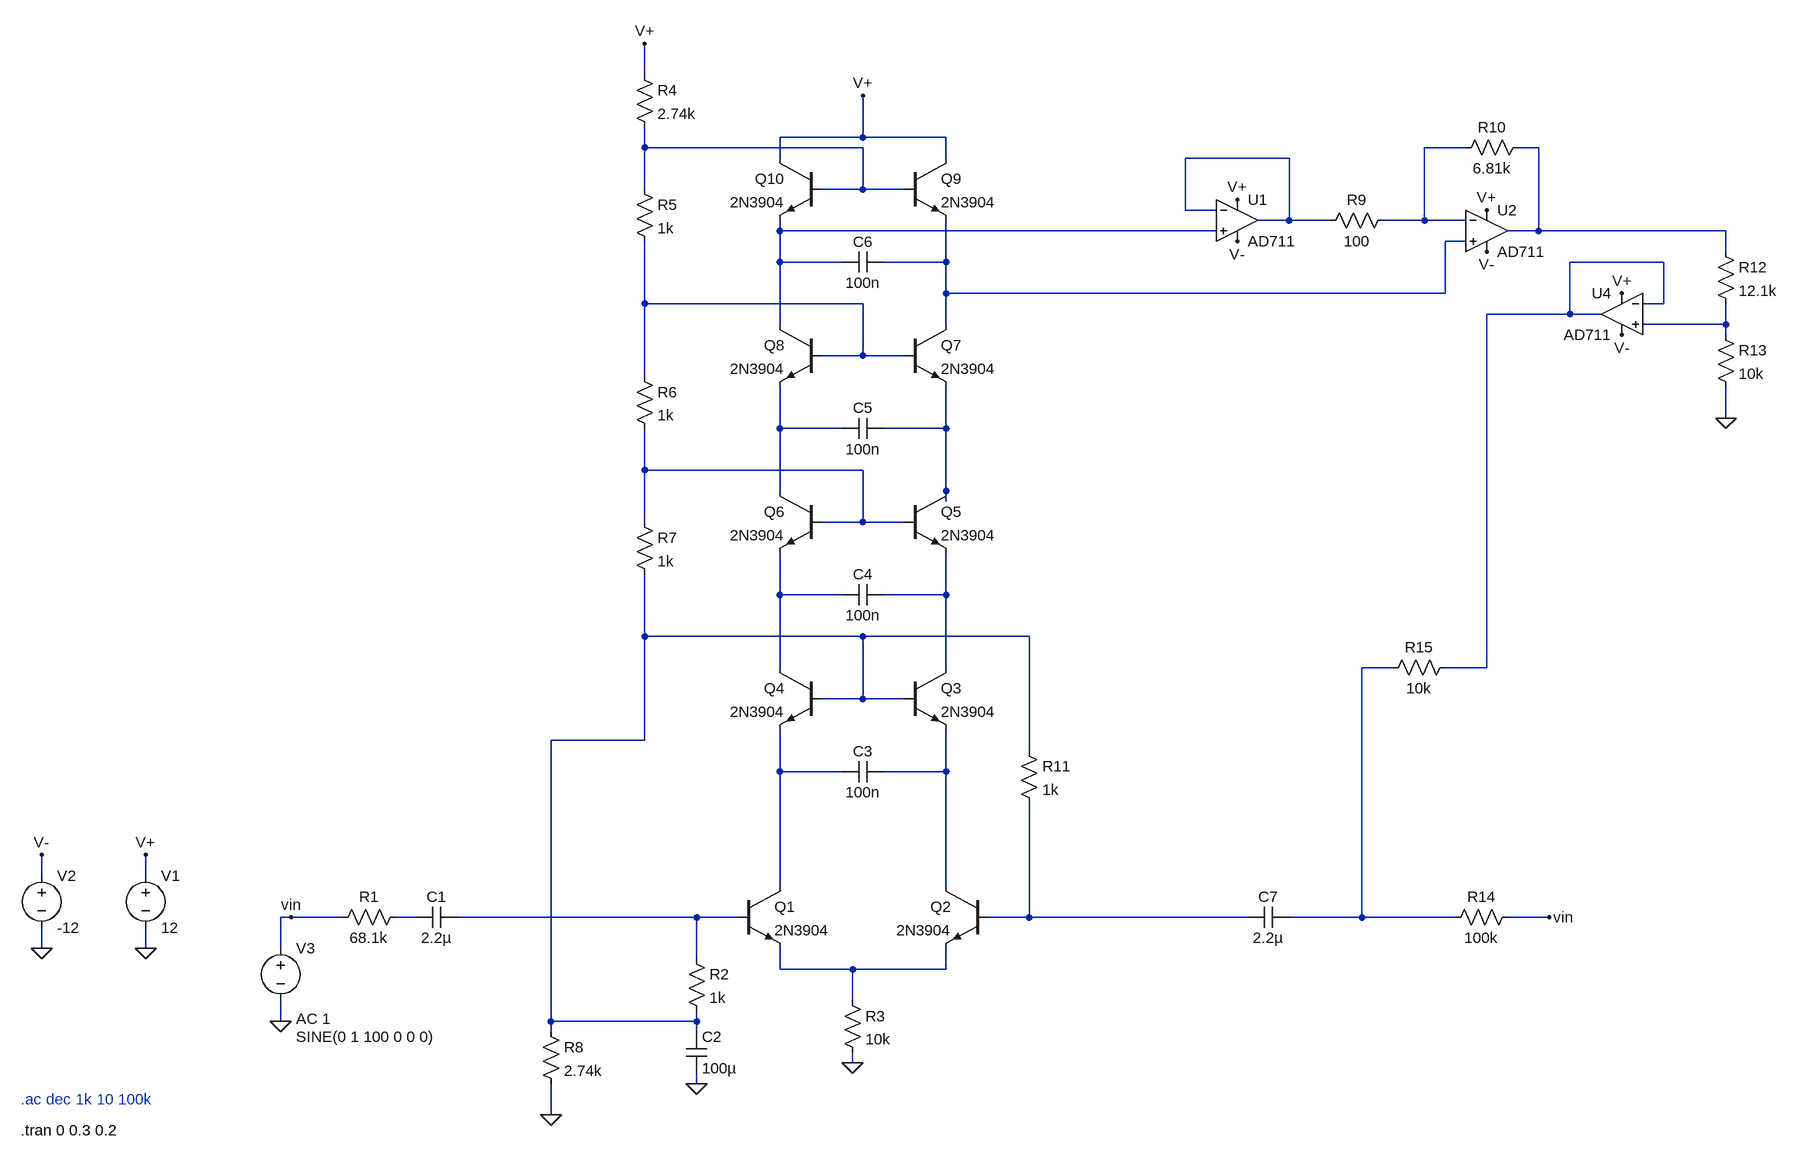
[diagram p0: schematic ladder filter.asc]
ladder filter.asc, the LTspice schematic file:
Version 4.1
SHEET 1 1992 680
WIRE 240 -1136 240 -1184
WIRE 576 -1040 576 -1104
WIRE 576 -1040 448 -1040
WIRE 704 -1040 576 -1040
WIRE 240 -1024 240 -1056
WIRE 576 -1024 240 -1024
WIRE 1504 -1024 1440 -1024
WIRE 1616 -1024 1584 -1024
WIRE 448 -1008 448 -1040
WIRE 704 -1008 704 -1040
WIRE 1232 -1008 1072 -1008
WIRE 240 -960 240 -1024
WIRE 576 -960 576 -1024
WIRE 576 -960 512 -960
WIRE 640 -960 576 -960
WIRE 1072 -928 1072 -1008
WIRE 1120 -928 1072 -928
WIRE 1232 -912 1232 -1008
WIRE 1232 -912 1184 -912
WIRE 1296 -912 1232 -912
WIRE 1440 -912 1440 -1024
WIRE 1440 -912 1376 -912
WIRE 1504 -912 1440 -912
WIRE 448 -896 448 -912
WIRE 1120 -896 448 -896
WIRE 1616 -896 1616 -1024
WIRE 1616 -896 1568 -896
WIRE 1904 -896 1616 -896
WIRE 1504 -880 1472 -880
WIRE 1904 -864 1904 -896
WIRE 448 -848 448 -896
WIRE 544 -848 448 -848
WIRE 704 -848 704 -912
WIRE 704 -848 608 -848
WIRE 1808 -848 1664 -848
WIRE 704 -800 704 -848
WIRE 1472 -800 1472 -880
WIRE 1472 -800 704 -800
WIRE 240 -784 240 -880
WIRE 576 -784 240 -784
WIRE 1808 -784 1808 -848
WIRE 1808 -784 1776 -784
WIRE 1664 -768 1664 -848
WIRE 1664 -768 1536 -768
WIRE 1712 -768 1664 -768
WIRE 448 -752 448 -848
WIRE 704 -752 704 -800
WIRE 1904 -752 1904 -784
WIRE 1904 -752 1776 -752
WIRE 1904 -736 1904 -752
WIRE 576 -704 576 -784
WIRE 576 -704 512 -704
WIRE 640 -704 576 -704
WIRE 240 -672 240 -784
WIRE 1904 -608 1904 -656
WIRE 448 -592 448 -656
WIRE 544 -592 448 -592
WIRE 704 -592 704 -656
WIRE 704 -592 608 -592
WIRE 240 -528 240 -592
WIRE 576 -528 240 -528
WIRE 448 -496 448 -592
WIRE 704 -496 704 -592
WIRE 704 -480 704 -496
WIRE 240 -448 240 -528
WIRE 576 -448 576 -528
WIRE 576 -448 512 -448
WIRE 640 -448 576 -448
WIRE 448 -336 448 -400
WIRE 544 -336 448 -336
WIRE 704 -336 704 -400
WIRE 704 -336 608 -336
WIRE 240 -272 240 -368
WIRE 576 -272 240 -272
WIRE 832 -272 576 -272
WIRE 448 -224 448 -336
WIRE 704 -224 704 -336
WIRE 1392 -224 1344 -224
WIRE 1536 -224 1536 -768
WIRE 1536 -224 1472 -224
WIRE 576 -176 576 -272
WIRE 576 -176 512 -176
WIRE 640 -176 576 -176
WIRE 240 -112 240 -272
WIRE 240 -112 96 -112
WIRE 832 -96 832 -272
WIRE 448 -64 448 -128
WIRE 544 -64 448 -64
WIRE 704 -64 704 -128
WIRE 704 -64 608 -64
WIRE -688 96 -688 64
WIRE -528 96 -528 64
WIRE 448 112 448 -64
WIRE 704 112 704 -64
WIRE -304 160 -320 160
WIRE -224 160 -304 160
WIRE -112 160 -144 160
WIRE 320 160 -48 160
WIRE 384 160 320 160
WIRE 832 160 832 -16
WIRE 832 160 768 160
WIRE 1168 160 832 160
WIRE 1344 160 1344 -224
WIRE 1344 160 1232 160
WIRE 1488 160 1344 160
WIRE 1632 160 1568 160
WIRE -688 208 -688 176
WIRE -528 208 -528 176
WIRE -320 208 -320 160
WIRE 320 224 320 160
WIRE 448 240 448 208
WIRE 560 240 448 240
WIRE 704 240 704 208
WIRE 704 240 560 240
WIRE 560 288 560 240
WIRE -320 320 -320 288
WIRE 96 320 96 -112
WIRE 320 320 320 304
WIRE 320 320 96 320
WIRE 96 336 96 320
WIRE 320 336 320 320
WIRE 560 384 560 368
WIRE 320 416 320 400
WIRE 96 464 96 416
FLAG 320 416 0
FLAG 560 384 0
FLAG -528 208 0
FLAG -528 64 V+
FLAG 240 -1184 V+
FLAG 576 -1104 V+
FLAG 96 464 0
FLAG -688 208 0
FLAG -688 64 V-
FLAG 1152 -880 V-
FLAG 1152 -944 V+
FLAG 1536 -864 V-
FLAG 1536 -928 V+
FLAG -320 320 0
FLAG -304 160 vin
FLAG 1632 160 vin
FLAG 1744 -800 V+
FLAG 1744 -736 V-
FLAG 1904 -608 0
SYMBOL cap -48 144 R90
WINDOW 0 0 32 VBottom 2
WINDOW 3 32 32 VTop 2
SYMATTR InstName C1
SYMATTR Value 2.2µ
SYMBOL res -128 144 R90
WINDOW 0 0 56 VBottom 2
WINDOW 3 32 56 VTop 2
SYMATTR InstName R1
SYMATTR Value 68.1k
SYMBOL npn 384 112 R0
SYMATTR InstName Q1
SYMATTR Value 2N3904
SYMBOL npn 768 112 M0
SYMATTR InstName Q2
SYMATTR Value 2N3904
SYMBOL res 304 208 R0
SYMATTR InstName R2
SYMATTR Value 1k
SYMBOL cap 304 336 R0
SYMATTR InstName C2
SYMATTR Value 100µ
SYMBOL res 544 272 R0
SYMATTR InstName R3
SYMATTR Value 10k
SYMBOL voltage -528 80 R0
WINDOW 123 0 0 Left 0
WINDOW 39 0 0 Left 0
SYMATTR InstName V1
SYMATTR Value 12
SYMBOL npn 640 -224 R0
SYMATTR InstName Q3
SYMATTR Value 2N3904
SYMBOL npn 512 -224 M0
SYMATTR InstName Q4
SYMATTR Value 2N3904
SYMBOL cap 608 -80 R90
WINDOW 0 0 32 VBottom 2
WINDOW 3 32 32 VTop 2
SYMATTR InstName C3
SYMATTR Value 100n
SYMBOL npn 640 -496 R0
SYMATTR InstName Q5
SYMATTR Value 2N3904
SYMBOL npn 512 -496 M0
SYMATTR InstName Q6
SYMATTR Value 2N3904
SYMBOL cap 608 -352 R90
WINDOW 0 0 32 VBottom 2
WINDOW 3 32 32 VTop 2
SYMATTR InstName C4
SYMATTR Value 100n
SYMBOL npn 640 -752 R0
SYMATTR InstName Q7
SYMATTR Value 2N3904
SYMBOL npn 512 -752 M0
SYMATTR InstName Q8
SYMATTR Value 2N3904
SYMBOL cap 608 -608 R90
WINDOW 0 0 32 VBottom 2
WINDOW 3 32 32 VTop 2
SYMATTR InstName C5
SYMATTR Value 100n
SYMBOL npn 640 -1008 R0
SYMATTR InstName Q9
SYMATTR Value 2N3904
SYMBOL npn 512 -1008 M0
SYMATTR InstName Q10
SYMATTR Value 2N3904
SYMBOL cap 608 -864 R90
WINDOW 0 0 32 VBottom 2
WINDOW 3 32 32 VTop 2
SYMATTR InstName C6
SYMATTR Value 100n
SYMBOL res 224 -1152 R0
SYMATTR InstName R4
SYMATTR Value 2.74k
SYMBOL res 224 -976 R0
SYMATTR InstName R5
SYMATTR Value 1k
SYMBOL res 224 -688 R0
SYMATTR InstName R6
SYMATTR Value 1k
SYMBOL res 224 -464 R0
SYMATTR InstName R7
SYMATTR Value 1k
SYMBOL res 80 320 R0
SYMATTR InstName R8
SYMATTR Value 2.74k
SYMBOL OpAmps\\AD711 1152 -976 R0
SYMATTR InstName U1
SYMBOL voltage -688 80 R0
WINDOW 123 0 0 Left 0
WINDOW 39 0 0 Left 0
SYMATTR InstName V2
SYMATTR Value -12
SYMBOL res 1392 -928 R90
WINDOW 0 0 56 VBottom 2
WINDOW 3 32 56 VTop 2
SYMATTR InstName R9
SYMATTR Value 100
SYMBOL OpAmps\\AD711 1536 -960 R0
SYMATTR InstName U2
SYMBOL res 1600 -1040 R90
WINDOW 0 0 56 VBottom 2
WINDOW 3 32 56 VTop 2
SYMATTR InstName R10
SYMATTR Value 6.81k
SYMBOL voltage -320 192 R0
WINDOW 3 24 152 Left 2
WINDOW 123 24 124 Left 2
WINDOW 39 0 0 Left 0
SYMATTR InstName V3
SYMATTR Value SINE(0 1 100 0 0 0)
SYMATTR Value2 AC 1
SYMBOL res 816 -112 R0
SYMATTR InstName R11
SYMATTR Value 1k
SYMBOL cap 1232 144 R90
WINDOW 0 0 32 VBottom 2
WINDOW 3 32 32 VTop 2
SYMATTR InstName C7
SYMATTR Value 2.2µ
SYMBOL res 1888 -880 R0
SYMATTR InstName R12
SYMATTR Value 12.1k
SYMBOL res 1888 -752 R0
SYMATTR InstName R13
SYMATTR Value 10k
SYMBOL res 1584 144 R90
WINDOW 0 0 56 VBottom 2
WINDOW 3 32 56 VTop 2
SYMATTR InstName R14
SYMATTR Value 100k
SYMBOL OpAmps\\AD711 1744 -832 M0
SYMATTR InstName U4
SYMBOL res 1488 -240 R90
WINDOW 0 0 56 VBottom 2
WINDOW 3 32 56 VTop 2
SYMATTR InstName R15
SYMATTR Value 10k
TEXT -720 440 Left 2 ;.ac dec 1k 10 100k
TEXT -720 488 Left 2 !.tran 0 0.3 0.2

The netlist it stands for:
* ladder filter.asc
C1 N020 N019 2.2µ
R1 N019 vin 68.1k
Q1 N017 N020 N022 0 2N3904
Q2 N018 N021 N022 0 2N3904
R2 N020 N015 1k
C2 N015 0 100µ
R3 N022 0 10k
V1 V+ 0 12
Q3 N014 N015 N018 0 2N3904
Q4 N013 N015 N017 0 2N3904
C3 N018 N017 100n
Q5 N011 N012 N014 0 2N3904
Q6 N010 N012 N013 0 2N3904
C4 N014 N013 100n
Q7 N006 N008 N011 0 2N3904
Q8 N005 N008 N010 0 2N3904
C5 N011 N010 100n
Q9 V+ N001 N006 0 2N3904
Q10 V+ N001 N005 0 2N3904
C6 N006 N005 100n
R4 V+ N001 2.74k
R5 N001 N008 1k
R6 N008 N012 1k
R7 N012 N015 1k
R8 N015 0 2.74k
X§U1 N005 N004 V+ V- N004 AD712  ; AD711, pins In+ In- V+ V- OUT
V2 V- 0 -12
R9 N002 N004 100
X§U2 N006 N002 V+ V- N003 AD712  ; AD711, pins In+ In- V+ V- OUT
R10 N003 N002 6.81k
V3 vin 0 SINE(0 1 100 0 0 0) AC 1
R11 N015 N021 1k
C7 N016 N021 2.2µ
R12 N003 N009 12.1k
R13 N009 0 10k
R14 vin N016 100k
X§U4 N009 N007 V+ V- N007 AD712  ; AD711, pins In+ In- V+ V- OUT
R15 N007 N016 10k
.model NPN NPN
.model PNP PNP
.lib standard.bjt
* .ac dec 1k 10 100k
.tran 0 0.3 0.2
.lib ADI1.lib
.backanno
.end